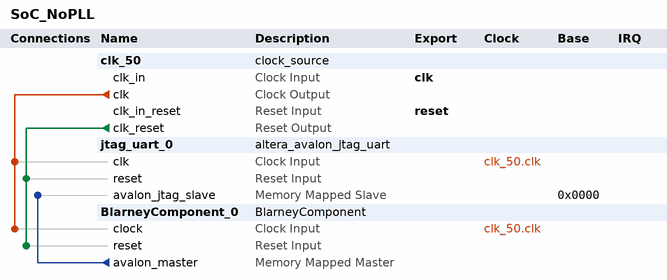
[diagram p0: system contents]
# Platform Designer (Qsys) system SoC_NoPLL, Cyclone V 5CSXFC6D6F31C8ES
# Parameters at their usual value, and those the tool derives, are not listed.
package require -exact qsys 16.1
create_system SoC_NoPLL
set_project_property DEVICE_FAMILY {Cyclone V}
set_project_property DEVICE 5CSXFC6D6F31C8ES

add_instance clk_50 clock_source 16.1
set_instance_parameter_value clk_50 clockFrequency 50000000

add_instance jtag_uart_0 altera_avalon_jtag_uart 16.1
set_instance_parameter_value jtag_uart_0 simInteractiveOptions NO_INTERACTIVE_WINDOWS

add_instance BlarneyComponent_0 BlarneyComponent 1.0

# connections
add_connection clk_50.clk BlarneyComponent_0.clock clock
add_connection clk_50.clk jtag_uart_0.clk clock
add_connection clk_50.clk_reset BlarneyComponent_0.reset reset
add_connection clk_50.clk_reset jtag_uart_0.reset reset
add_connection BlarneyComponent_0.avalon_master jtag_uart_0.avalon_jtag_slave avalon
set_connection_parameter_value BlarneyComponent_0.avalon_master/jtag_uart_0.avalon_jtag_slave baseAddress 0x0000

# exported interfaces
add_interface clk clock sink
set_interface_property clk EXPORT_OF clk_50.clk_in
add_interface reset reset sink
set_interface_property reset EXPORT_OF clk_50.clk_in_reset

set_interconnect_requirement {$system} qsys_mm.clockCrossingAdapter FIFO
set_interconnect_requirement {$system} qsys_mm.maxAdditionalLatency 4

save_system SoC_NoPLL.qsys
